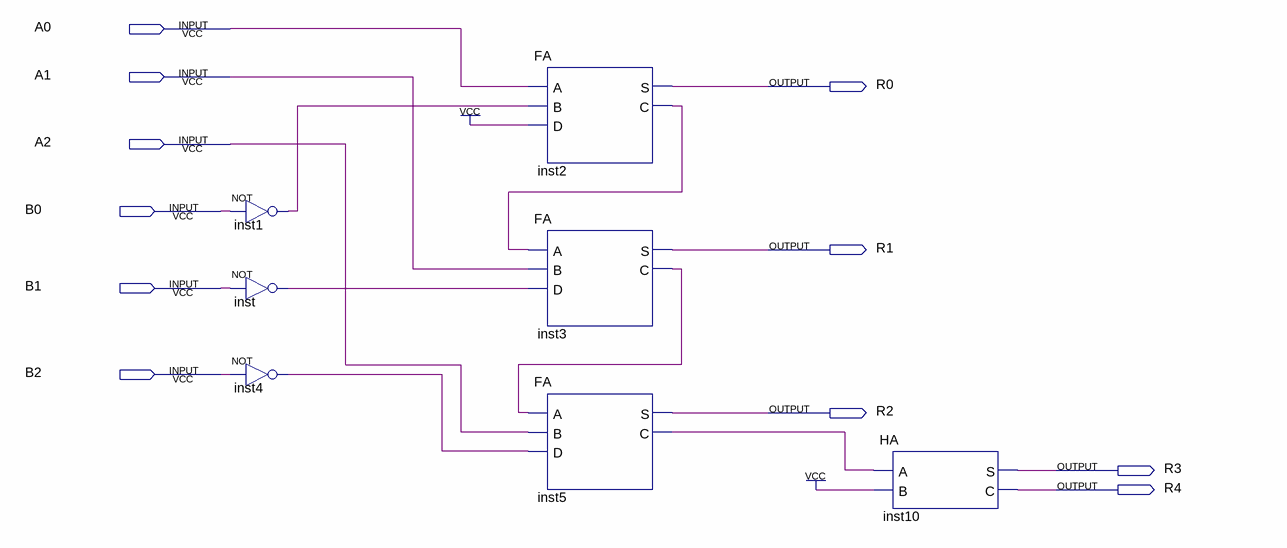
[diagram p0: schematic sheet]
// Quartus schematic Resta.bdf as structural Verilog: 7 symbols, 11 pins
module Resta (
  input  A0,
  input  A1,
  input  A2,
  input  B0,
  input  B1,
  input  B2,
  output R0,
  output R1,
  output R2,
  output R3,
  output R4
);

  wire inst1_out, inst2_c, inst3_c, inst4_out, inst5_c, inst_out;

  not inst1 (inst1_out, B0);
  not inst (inst_out, B1);
  not inst4 (inst4_out, B2);
  FA inst2 (.A(A0), .B(inst1_out), .D(1'b1), .S(R0), .C(inst2_c));
  FA inst3 (.A(inst2_c), .B(A1), .D(inst_out), .S(R1), .C(inst3_c));
  FA inst5 (.A(inst3_c), .B(A2), .D(inst4_out), .S(R2), .C(inst5_c));
  HA inst10 (.A(inst5_c), .B(1'b1), .S(R3), .C(R4));
endmodule
